# EAGLE schematic L298 (EAGLE 6.4)
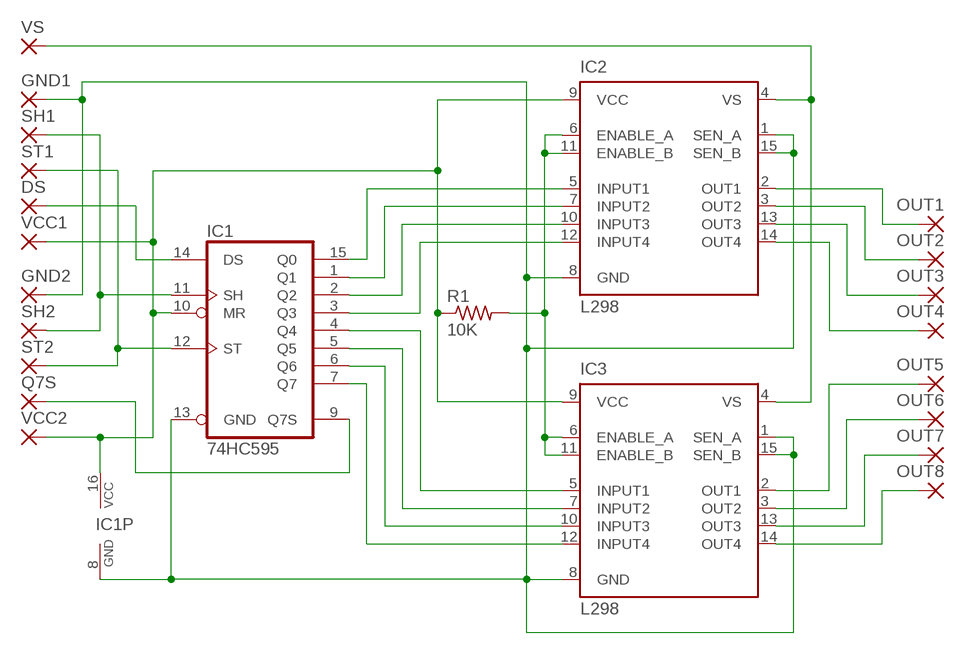
[diagram p0: schematic, sheet 1]

## Parts
DS  1,6/0,8  [1,6/0,8]
GND1  1,6/0,8  [1,6/0,8]
GND2  1,6/0,8  [1,6/0,8]
IC1  74HC595  74HC595N  [DIL16]
IC2  L298  [MULTIWATT-15]
IC3  L298  [MULTIWATT-15]
OUT1  1,6/0,8  [1,6/0,8]
OUT2  1,6/0,8  [1,6/0,8]
OUT3  1,6/0,8  [1,6/0,8]
OUT4  1,6/0,8  [1,6/0,8]
OUT5  1,6/0,8  [1,6/0,8]
OUT6  1,6/0,8  [1,6/0,8]
OUT7  1,6/0,8  [1,6/0,8]
OUT8  1,6/0,8  [1,6/0,8]
Q7S  1,6/0,8  [1,6/0,8]
R1  10K  R-US_0411/12  [0411/12]
SH1  1,6/0,8  [1,6/0,8]
SH2  1,6/0,8  [1,6/0,8]
ST1  1,6/0,8  [1,6/0,8]
ST2  1,6/0,8  [1,6/0,8]
VCC1  1,6/0,8  [1,6/0,8]
VCC2  1,6/0,8  [1,6/0,8]
VS  1,6/0,8  [1,6/0,8]

## Nets
GND: GND1.1(P) GND2.1(P) IC1.8(GND) IC1.13(GND) IC2.1(SEN_A) IC2.8(GND) IC2.15(SEN_B) IC3.1(SEN_A) IC3.8(GND) IC3.15(SEN_B)
N$1: DS.1(P) IC1.14(DS)
N$2: IC1.4(Q4) IC3.5(INPUT1)
N$3: IC1.5(Q5) IC3.7(INPUT2)
N$4: IC2.2(OUT1) OUT1.1(P)
N$5: IC2.3(OUT2) OUT2.1(P)
N$6: IC2.13(OUT3) OUT3.1(P)
N$7: IC2.14(OUT4) OUT4.1(P)
N$8: IC3.2(OUT1) OUT5.1(P)
N$9: IC3.3(OUT2) OUT6.1(P)
N$10: IC2.6(ENABLE_A) IC2.11(ENABLE_B) IC3.6(ENABLE_A) IC3.11(ENABLE_B) R1.2
N$11: IC3.13(OUT3) OUT7.1(P)
N$12: IC1.6(Q6) IC3.10(INPUT3)
N$13: IC3.14(OUT4) OUT8.1(P)
N$17: IC1.15(Q0) IC2.5(INPUT1)
N$18: IC1.1(Q1) IC2.7(INPUT2)
N$19: IC1.2(Q2) IC2.10(INPUT3)
N$20: IC1.3(Q3) IC2.12(INPUT4)
N$21: IC1.7(Q7) IC3.12(INPUT4)
N$22: IC1.11(SH) SH1.1(P) SH2.1(P)
N$23: IC1.9(Q7S) Q7S.1(P)
N$26: IC1.12(ST) ST1.1(P) ST2.1(P)
VCC: IC1.10(MR) IC1.16(VCC) IC2.9(VCC) IC3.9(VCC) R1.1 VCC1.1(P) VCC2.1(P)
VS: IC2.4(VS) IC3.4(VS) VS.1(P)

## Library data of the parts
DS GND1 GND2 OUT1-OUT8 Q7S SH1 SH2 ST1 ST2 VCC1 VCC2 VS = wirepad:1,6/0,8: THROUGH-HOLE PAD
IC1 = 74xx-eu:74*595: 8-bit SHIFT REGISTER, output latch
IC2 IC3 = st-microelectronics:L298: DUAL FULL-BRIDGE DRIVER; MPN: L298N; OC_FARNELL: 1589425; OC_NEWARK: 32M1527
R1 = rcl:R-US_: RESISTOR, American symbol